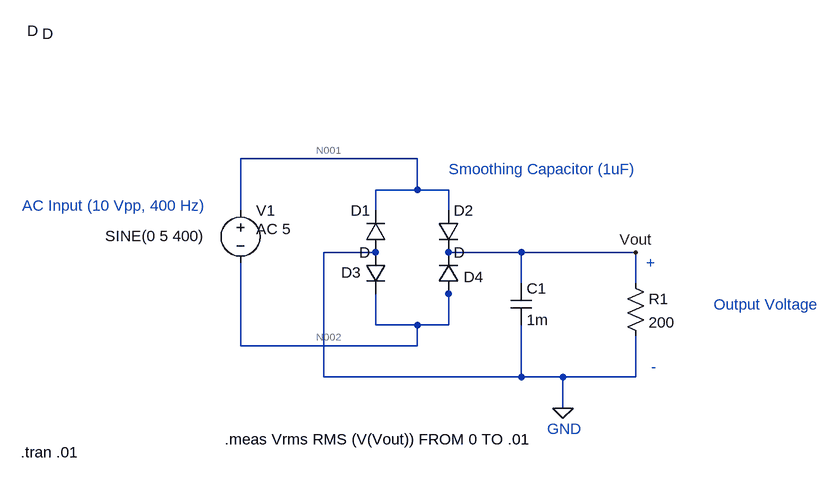
[diagram p0: schematic Rectifier.asc]
Rectifier.asc, the LTspice schematic file:
Version 4
SHEET 1 880 680
WIRE 224 0 -48 0
WIRE 224 48 224 0
WIRE 224 48 160 48
WIRE 272 48 224 48
WIRE -48 80 -48 0
WIRE 160 80 160 48
WIRE 272 80 272 48
WIRE 160 144 80 144
WIRE 384 144 272 144
WIRE 560 144 384 144
WIRE 384 192 384 144
WIRE 560 192 560 144
WIRE 272 208 272 192
WIRE 160 256 160 208
WIRE 224 256 160 256
WIRE 272 256 272 208
WIRE 272 256 224 256
WIRE -48 288 -48 160
WIRE 224 288 224 256
WIRE 224 288 -48 288
WIRE 80 336 80 144
WIRE 384 336 384 256
WIRE 384 336 80 336
WIRE 448 336 384 336
WIRE 560 336 560 272
WIRE 560 336 448 336
WIRE 448 384 448 336
FLAG 448 384 0
FLAG 560 144 Vout
SYMBOL voltage -48 64 R0
WINDOW 3 -208 55 Left 2
WINDOW 123 24 44 Left 2
WINDOW 39 0 0 Left 0
SYMATTR Value SINE(0 5 400)
SYMATTR Value2 AC 5
SYMATTR InstName V1
SYMBOL diode 256 80 R0
SYMATTR InstName D2
SYMBOL diode 288 208 R180
WINDOW 0 -38 26 Left 2
WINDOW 3 647 405 Left 2
SYMATTR InstName D4
SYMBOL cap 368 192 R0
SYMATTR InstName C1
SYMATTR Value 1m
SYMBOL res 544 176 R0
SYMATTR InstName R1
SYMATTR Value 200
SYMBOL diode 176 144 R180
WINDOW 0 24 64 Left 2
WINDOW 3 24 0 Left 2
SYMATTR InstName D1
SYMBOL diode 144 144 R0
WINDOW 0 -37 31 Left 2
WINDOW 3 -497 -337 Left 2
SYMATTR InstName D3
TEXT -384 72 Left 2 ;AC Input (10 Vpp, 400 Hz)
TEXT 272 16 Left 2 ;Smoothing Capacitor (1uF)
TEXT 680 224 Left 2 ;Output Voltage
TEXT 576 160 Left 2 ;+
TEXT 584 320 Left 2 ;-
TEXT 424 416 Left 2 ;GND
TEXT -72 432 Left 2 !.meas Vrms RMS (V(Vout)) FROM 0 TO .01
TEXT -386 452 Left 2 !.tran .01

The netlist it stands for:
* Rectifier.asc
V1 N001 N002 SINE(0 5 400) AC 5
D2 N001 Vout D
D4 N002 Vout D
C1 Vout 0 1m
R1 Vout 0 200
D1 0 N001 D
D3 0 N002 D
.model D D
.lib standard.dio
* AC Input (10 Vpp, 400 Hz)
* Smoothing Capacitor (1uF)
* Output Voltage
* +
* -
* GND
.meas Vrms RMS (V(Vout)) FROM 0 TO .01
.tran .01
.backanno
.end

* Results of the author's LTspice run, read from the files saved beside the schematic
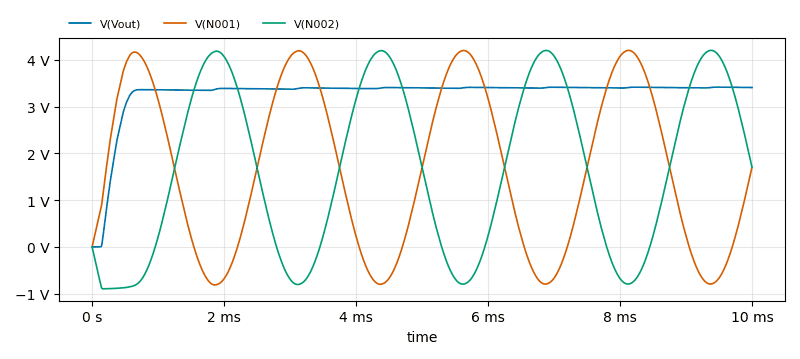
[diagram p1: Transient Analysis of Rectifier.asc, plotted from the saved traces]
* Transient Analysis, 1 run:
*   V(Vout): min 0 V, max 3.42 V, average 3.285 V, rms 3.328 V, last 3.411 V
*   V(N001): min -813.9 mV, max 4.205 V, average 1.642 V, rms 2.406 V, last 1.705 V
*   V(N002): min -896.9 mV, max 4.206 V, average 1.643 V, rms 2.455 V, last 1.705 V
* From the log:
*   vrms: RMS(v(vout))=3.3279 FROM 0 TO 0.01